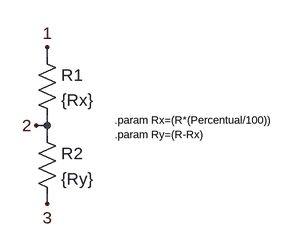
[diagram p0: schematic _Trimpot.asc]
_Trimpot.asc, the LTspice schematic file:
Version 4
SHEET 1 880 680
WIRE 160 48 160 32
WIRE 160 144 160 128
WIRE 160 144 144 144
WIRE 160 160 160 144
WIRE 160 256 160 240
FLAG 160 32 1
FLAG 144 144 2
FLAG 160 256 3
SYMBOL res 144 32 R0
SYMATTR InstName R1
SYMATTR Value {Rx}
SYMBOL res 144 144 R0
SYMATTR InstName R2
SYMATTR Value {Ry}
TEXT 256 136 Left 1 !.param Rx=(R*(Percentual/100))\n.param Ry=(R-Rx)

The netlist it stands for:
* _Trimpot.asc
R1 1 2 {Rx}
R2 2 3 {Ry}
.param Rx=(R*(Percentual/100))
.param Ry=(R-Rx)
.backanno
.end